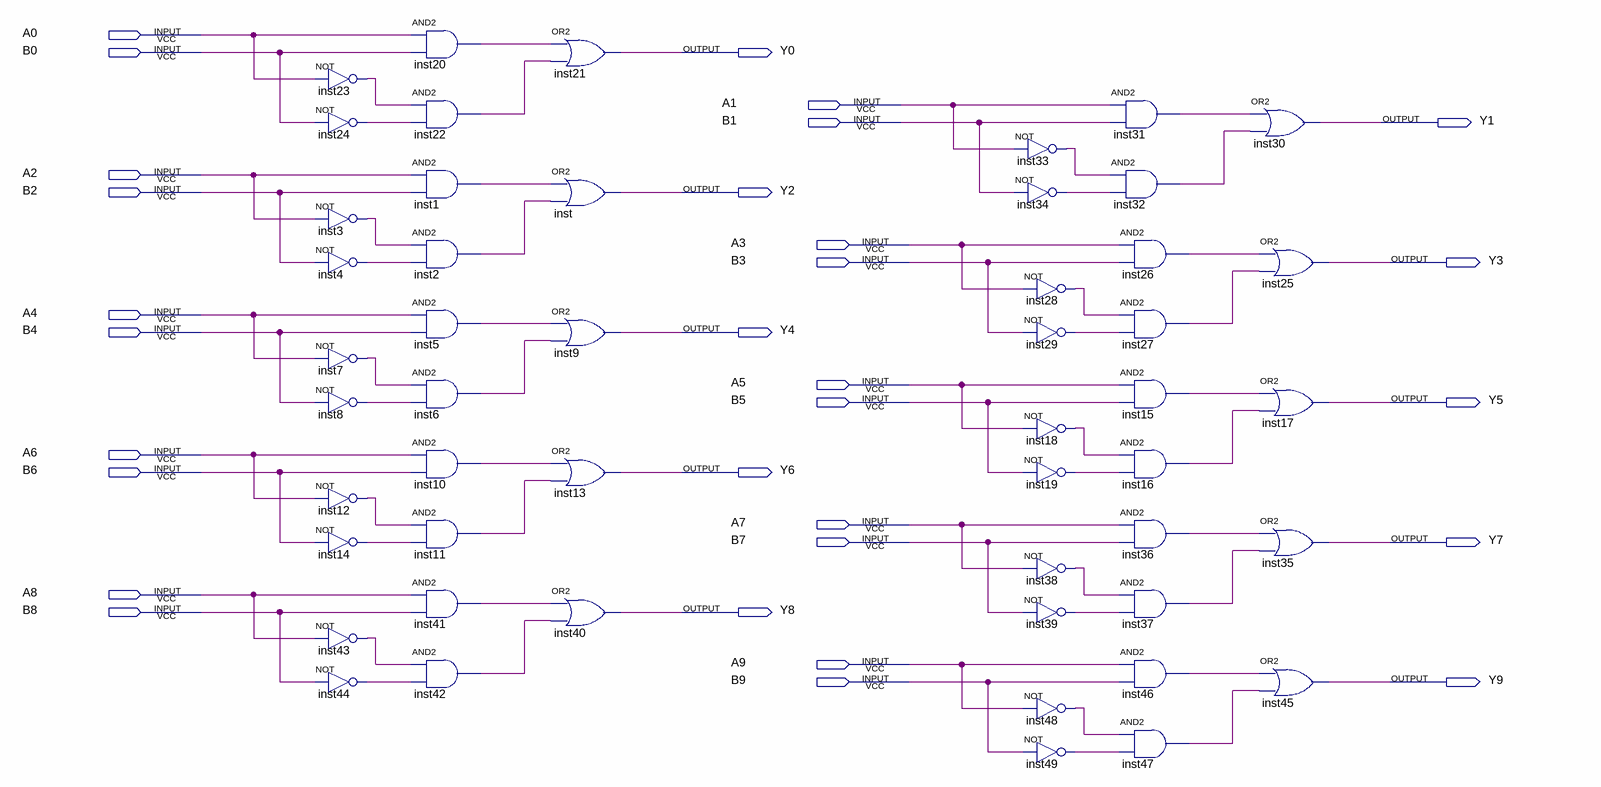
[diagram p0: schematic sheet]
// Quartus schematic CMP.bdf as structural Verilog: 50 symbols, 30 pins
module CMP (
  input  A0,
  input  B0,
  input  A1,
  input  B1,
  input  A2,
  input  B2,
  input  A3,
  input  B3,
  input  A4,
  input  B4,
  input  A5,
  input  B5,
  input  A6,
  input  B6,
  input  A7,
  input  B7,
  input  A8,
  input  B8,
  input  A9,
  input  B9,
  output Y0,
  output Y1,
  output Y2,
  output Y3,
  output Y4,
  output Y5,
  output Y6,
  output Y7,
  output Y8,
  output Y9
);

  wire inst1_out, inst2_out, inst3_out, inst4_out, inst5_out, inst6_out, inst7_out, inst8_out, inst10_out,
       inst11_out, inst12_out, inst14_out, inst15_out, inst16_out, inst18_out, inst19_out, inst20_out,
       inst22_out, inst23_out, inst24_out, inst26_out, inst27_out, inst28_out, inst29_out, inst31_out,
       inst32_out, inst33_out, inst34_out, inst36_out, inst37_out, inst38_out, inst39_out, inst41_out,
       inst42_out, inst43_out, inst44_out, inst46_out, inst47_out, inst48_out, inst49_out;

  not inst23 (inst23_out, A0);
  not inst24 (inst24_out, B0);
  not inst3 (inst3_out, A2);
  not inst4 (inst4_out, B2);
  not inst7 (inst7_out, A4);
  not inst8 (inst8_out, B4);
  not inst12 (inst12_out, A6);
  not inst14 (inst14_out, B6);
  not inst43 (inst43_out, A8);
  not inst44 (inst44_out, B8);
  and inst20 (inst20_out, A0, B0);
  and inst22 (inst22_out, inst23_out, inst24_out);
  and inst1 (inst1_out, A2, B2);
  and inst2 (inst2_out, inst3_out, inst4_out);
  and inst5 (inst5_out, A4, B4);
  and inst6 (inst6_out, inst7_out, inst8_out);
  and inst10 (inst10_out, A6, B6);
  and inst11 (inst11_out, inst12_out, inst14_out);
  and inst41 (inst41_out, A8, B8);
  and inst42 (inst42_out, inst43_out, inst44_out);
  or inst21 (Y0, inst20_out, inst22_out);
  or inst (Y2, inst1_out, inst2_out);
  or inst9 (Y4, inst5_out, inst6_out);
  or inst13 (Y6, inst10_out, inst11_out);
  or inst40 (Y8, inst41_out, inst42_out);
  not inst33 (inst33_out, A1);
  not inst34 (inst34_out, B1);
  not inst28 (inst28_out, A3);
  not inst29 (inst29_out, B3);
  not inst18 (inst18_out, A5);
  not inst19 (inst19_out, B5);
  not inst38 (inst38_out, A7);
  not inst39 (inst39_out, B7);
  not inst48 (inst48_out, A9);
  not inst49 (inst49_out, B9);
  and inst31 (inst31_out, A1, B1);
  and inst32 (inst32_out, inst33_out, inst34_out);
  and inst26 (inst26_out, A3, B3);
  and inst27 (inst27_out, inst28_out, inst29_out);
  and inst15 (inst15_out, A5, B5);
  and inst16 (inst16_out, inst18_out, inst19_out);
  and inst36 (inst36_out, A7, B7);
  and inst37 (inst37_out, inst38_out, inst39_out);
  and inst46 (inst46_out, A9, B9);
  and inst47 (inst47_out, inst48_out, inst49_out);
  or inst30 (Y1, inst31_out, inst32_out);
  or inst25 (Y3, inst26_out, inst27_out);
  or inst17 (Y5, inst15_out, inst16_out);
  or inst35 (Y7, inst36_out, inst37_out);
  or inst45 (Y9, inst46_out, inst47_out);
endmodule
